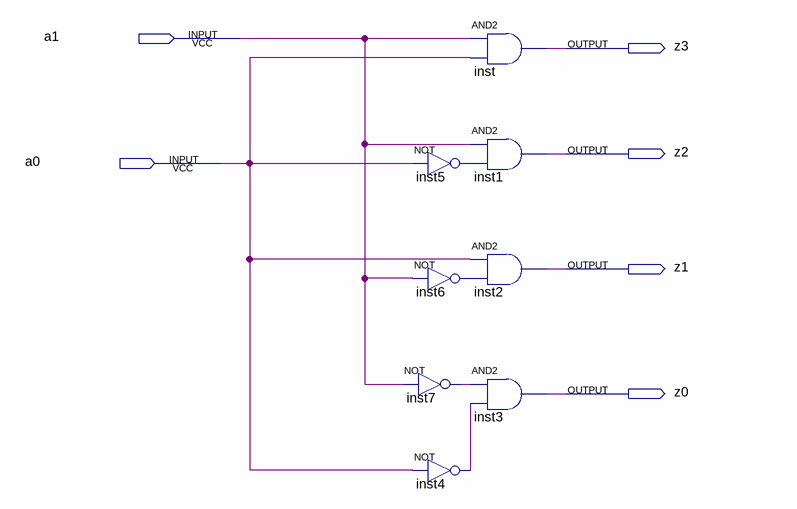
[diagram p0: schematic sheet]
// Quartus schematic 2_4.bdf as structural Verilog: 8 symbols, 6 pins
module \2_4  (
  input  a1,
  input  a0,
  output z3,
  output z2,
  output z1,
  output z0
);

  wire inst4_out, inst5_out, inst6_out, inst7_out;

  not inst7 (inst7_out, a1);
  and inst (z3, a1, a0);
  and inst1 (z2, a1, inst5_out);
  not inst5 (inst5_out, a0);
  and inst2 (z1, a0, inst6_out);
  not inst6 (inst6_out, a1);
  and inst3 (z0, inst7_out, inst4_out);
  not inst4 (inst4_out, a0);
endmodule
